# Altium schematic sheet FRDM-MCXA153__Shield_Template.SchDoc
size B; Organization: Altium Limited; Address1: 3 Minna Close; Address2: Belrose; Address3: NSW 2085; Address4: Australia; SheetNumber: 2; SheetTotal: 3; PAGE_TITLE: -
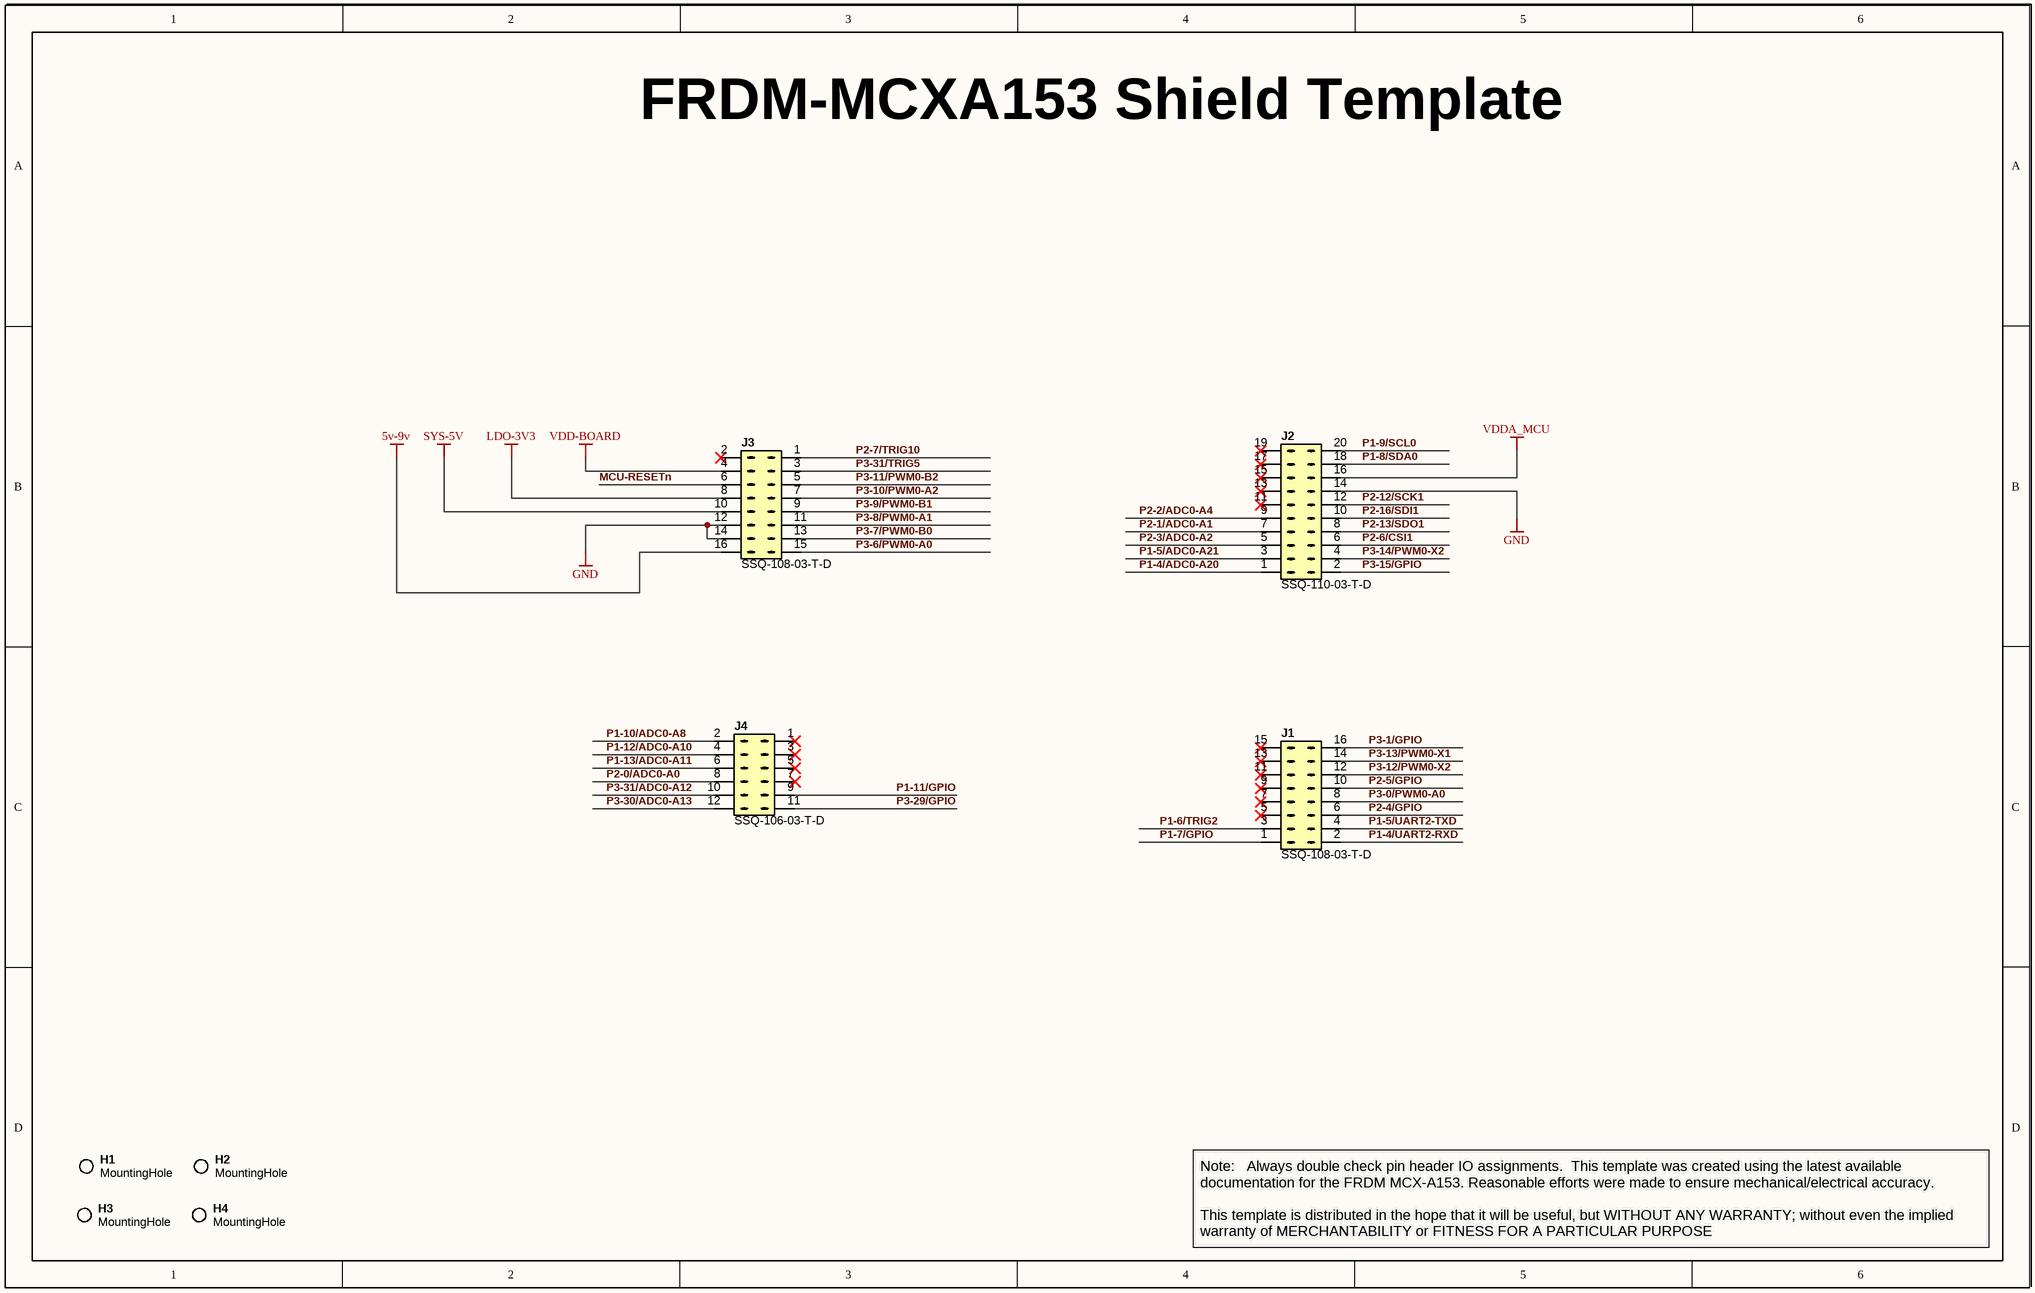
[diagram p0: FRDM-MCXA153__Shield_Template.SchDoc]

## Parts
H1  value MountingHole  [MountingHole_3.2mm_M3]  (hidden comment: Mechanical_MountingHole)
H2  value MountingHole  [MountingHole_3.2mm_M3]  (hidden comment: Mechanical_MountingHole)
H3  value MountingHole  [MountingHole_3.2mm_M3]  (hidden comment: Mechanical_MountingHole)
H4  value MountingHole  [MountingHole_3.2mm_M3]  (hidden comment: Mechanical_MountingHole)
J1  SSQ-108-03-T-D  [SSQ-108-03-T-D]
J2  SSQ-110-03-T-D  [SSQ-110-03-T-D]
J3  SSQ-108-03-T-D  [SSQ-108-03-T-D]
J4  SSQ-106-03-T-D  [SSQ-106-03-T-D]

## Nets
5v-9v: J3.16(Pin_16)
GND: J2.14(Pin_14) J3.12(Pin_12) J3.14(Pin_14)
LDO-3V3: J3.8(Pin_8)
SYS-5V: J3.10(Pin_10)
VDD-BOARD: J3.4(Pin_4)
VDDA_MCU: J2.16(Pin_16)
MCU-RESETn: J3.6(Pin_6)
P1-4/ADC0-A20: J2.1(Pin_1)
P1-4/UART2-RXD: J1.2(Pin_2)
P1-5/ADC0-A21: J2.3(Pin_3)
P1-5/UART2-TXD: J1.4(Pin_4)
P1-6/TRIG2: J1.3(Pin_3)
P1-7/GPIO: J1.1(Pin_1)
P1-8/SDA0: J2.18(Pin_18)
P1-9/SCL0: J2.20(Pin_20)
P1-10/ADC0-A8: J4.2(Pin_2)
P1-11/GPIO: J4.9(Pin_9)
P1-12/ADC0-A10: J4.4(Pin_4)
P1-13/ADC0-A11: J4.6(Pin_6)
P2-0/ADC0-A0: J4.8(Pin_8)
P2-1/ADC0-A1: J2.7(Pin_7)
P2-2/ADC0-A4: J2.9(Pin_9)
P2-3/ADC0-A2: J2.5(Pin_5)
P2-4/GPIO: J1.6(Pin_6)
P2-5/GPIO: J1.10(Pin_10)
P2-6/CSI1: J2.6(Pin_6)
P2-7/TRIG10: J3.1(Pin_1)
P2-12/SCK1: J2.12(Pin_12)
P2-13/SDO1: J2.8(Pin_8)
P2-16/SDI1: J2.10(Pin_10)
P3-0/PWM0-A0: J1.8(Pin_8)
P3-1/GPIO: J1.16(Pin_16)
P3-6/PWM0-A0: J3.15(Pin_15)
P3-7/PWM0-B0: J3.13(Pin_13)
P3-8/PWM0-A1: J3.11(Pin_11)
P3-9/PWM0-B1: J3.9(Pin_9)
P3-10/PWM0-A2: J3.7(Pin_7)
P3-11/PWM0-B2: J3.5(Pin_5)
P3-12/PWM0-X2: J1.12(Pin_12)
P3-13/PWM0-X1: J1.14(Pin_14)
P3-14/PWM0-X2: J2.4(Pin_4)
P3-15/GPIO: J2.2(Pin_2)
P3-29/GPIO: J4.11(Pin_11)
P3-30/ADC0-A13: J4.12(Pin_12)
P3-31/ADC0-A12: J4.10(Pin_10)
P3-31/TRIG5: J3.3(Pin_3)

Not connected (* = marked no-connect by the designer): J1 5(Pin_5)* 7(Pin_7)* 9(Pin_9)* 11(Pin_11)* 13(Pin_13)* 15(Pin_15)*; J2 11(Pin_11)* 13(Pin_13)* 15(Pin_15)* 17(Pin_17)* 19(Pin_19)*; J3 2(Pin_2)*; J4 1(Pin_1)* 3(Pin_3)* 5(Pin_5)* 7(Pin_7)*

## Notes on the sheet
- FRDM-MCXA153 Shield Template
- Note:   Always double check pin header IO assignments.  This template was created using the latest available documentation for the FRDM MCX-A153. Reasonable efforts were made to ensure mechanical/electrical accuracy.
  This template is distributed in the hope that it will be useful, but WITHOUT ANY WARRANTY; without even the implied warranty of MERCHANTABILITY or FITNESS FOR A PARTICULAR PURPOSE

## Library data of the parts
H1-H4 = Mechanical_MountingHole: Add into BOM: yes; Name: Mechanical_MountingHole; Symbol: Mechanical_MountingHole; Device: Mechanical_MountingHole; User doc link: ~; Convert to PCB: yes; Origin Footprint: MountingHole_3.2mm_M3
J1 J3 = SSQ-108-03-T-D: Manufacturer: Samtec Inc.; Name: Connector_Generic_Conn_02x08_Odd_Even; Add into BOM: yes; Symbol: Connector_Generic_Conn_02x08_Odd_Even; Device: Connector_Generic_Conn_02x08_Odd_Even; Value: SSQ-108-03-T-D; User doc link: ~; Supplier: Digikey; Supplier P/N: SAM10741-ND; Manufacturer Part Number: SSQ-108-03-T-D; Convert to PCB: yes; Origin Footprint: SSQ-108-03-T-D
J2 = SSQ-110-03-T-D: Manufacturer: Samtec Inc.; Name: Connector_Generic_Conn_02x10_Odd_Even; Add into BOM: yes; Symbol: Connector_Generic_Conn_02x10_Odd_Even; Device: Connector_Generic_Conn_02x10_Odd_Even; Value: SSQ-110-03-T-D; User doc link: ~; Supplier: Digikey; Supplier P/N: SAM10741-ND; Convert to PCB: yes; Origin Footprint: SSQ-110-03-T-D; Manufacturer Part Number: SSQ-110-03-T-D
J4 = SSQ-106-03-T-D: Manufacturer: Samtec Inc.; Name: Connector_Generic_Conn_02x06_Odd_Even; Add into BOM: yes; Symbol: Connector_Generic_Conn_02x06_Odd_Even; Device: Connector_Generic_Conn_02x06_Odd_Even; Value: SSQ-106-03-T-D; User doc link: ~; Supplier: Digikey; Supplier P/N: SAM1204-06-ND; Manufacturer Part Number: SSQ-106-03-T-D; Convert to PCB: yes; Origin Footprint: SSQ-106-03-T-D